# EAGLE design LDR ACC (EAGLE 9.0.0)
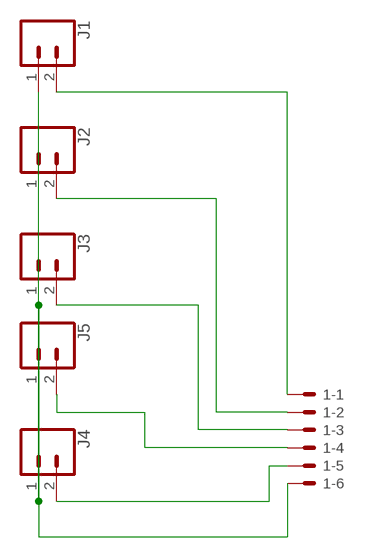
[diagram p0: schematic, sheet 1]

## Parts
1  5566-6  [5566-6]
J1  CONN_02PTH3  [1X02_LONGPADS]
J2  CONN_02PTH3  [1X02_LONGPADS]
J3  CONN_02PTH3  [1X02_LONGPADS]
J4  CONN_02PTH3  [1X02_LONGPADS]
J5  CONN_02PTH3  [1X02_LONGPADS]

## Nets
N$1: 1.6 J1.1 J2.1 J3.1 J4.1 J5.1
N$2: 1.5 J4.2
N$3: 1.4 J5.2
N$5: 1.3 J3.2
N$6: 1.2 J2.2
N$7: 1.1 J1.2

## Library data of the parts
1 = con-molex:5566-6: Mini FIT connector 6 pol Source: http://www.molex.com; MF: MOLEX; MPN: 95566-61002; OC_FARNELL: unknown; OC_NEWARK: 22K8620
J1-J5 = SparkFun-Connectors:CONN_02: Multi connection point. Often used as Generic Header-pin footprint for 0.1 inch spaced/style header connections On any of the 0.1 inch spaced packages, you can populate with these: Break Away Headers - Straight <https://www.sparkfun.com/products/116> (PRT-00116) Break Away Male Headers - Right Angle <https://www.sparkfun.com/products/553> (PRT-00553) Female Headers <https://www.sparkfun.com/products/115> (PRT-00115) Break Away Headers - Machine Pin <https://www.sparkfun.com/products/117> (PRT-00117) Break Away Female Headers - Swiss Machine Pin <https://www.sparkfun.com/products/743> (PRT-00743) For SCREWTERMINALS and SPRING TERMINALS visit here: Screw Terimnals on SparkFun.com <https://www.sparkfun.com/search/results?term=Screw+Terminals> (5mm/3.5mm/2.54mm spacing) This device is also useful as a general connection point to wire up your design to another part of your project. Our various solder wires solder well into these plated through hole pads. Hook-Up Wire - Assortment (Stranded, 22 AWG) <https://www.sparkfun.com/products/11375> (PRT-11375) Hook-Up Wire - Assortment (Solid Core, 22 AWG) <https://www.sparkfun.com/products/11367> (PRT-11367) View the entire wire category on our website here <https://www.sparkfun.com/categories/141> Special notes: Molex polarized connector foot print use with: PRT-08233 with associated crimp pins and housings. 2.54_SCREWTERM for use with PRT-10571. 3.5mm Screw Terminal footprints for PRT-08084 5mm Screw Terminal footprints for use with PRT-08432

## Board
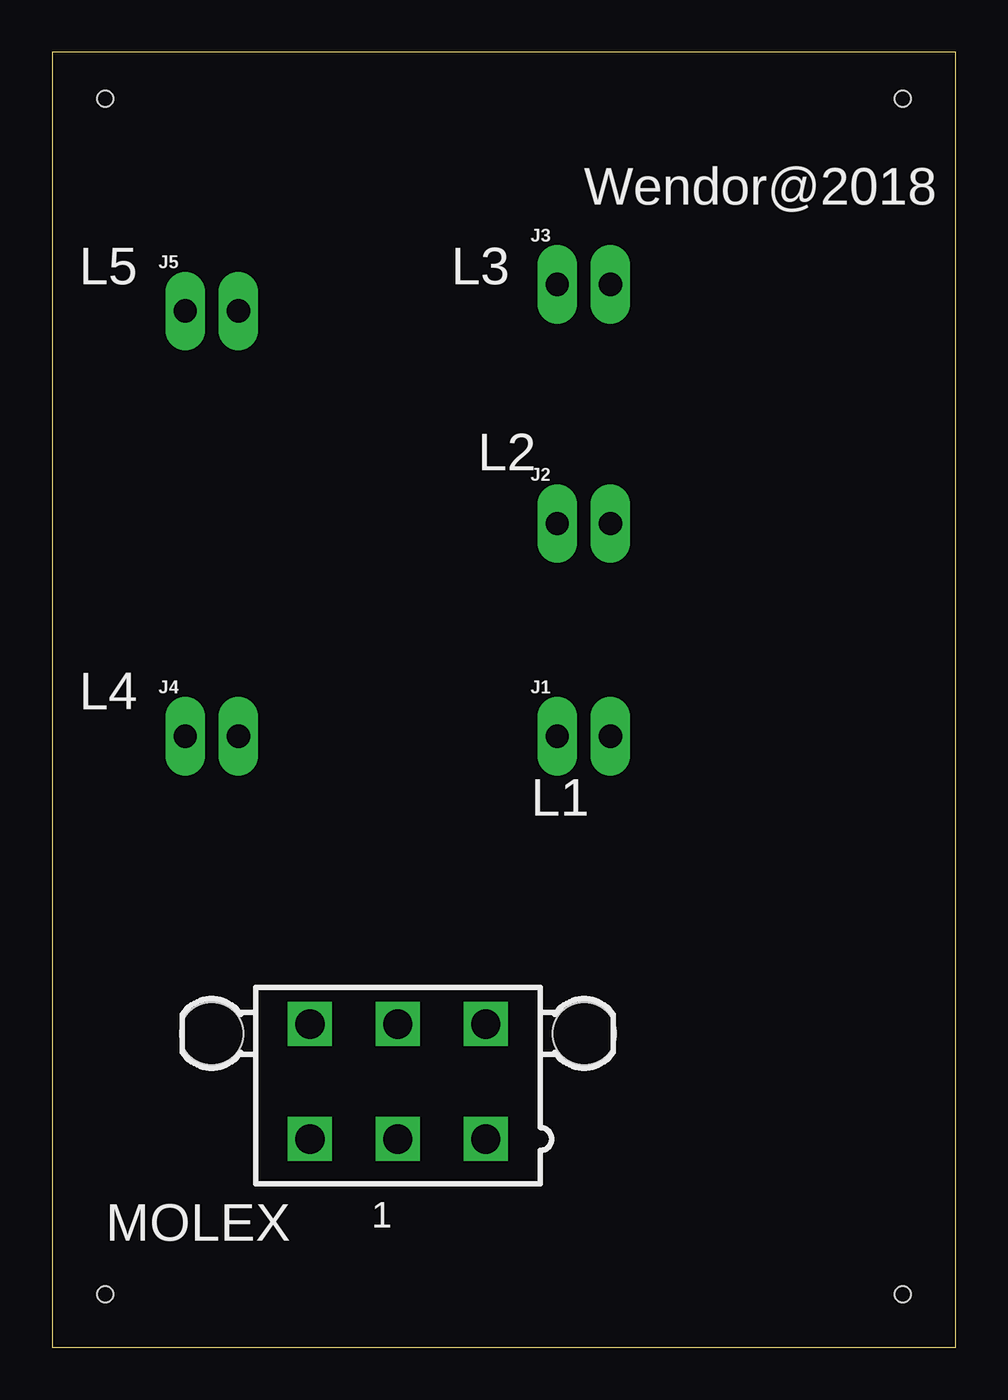
[diagram p1: board, top side]
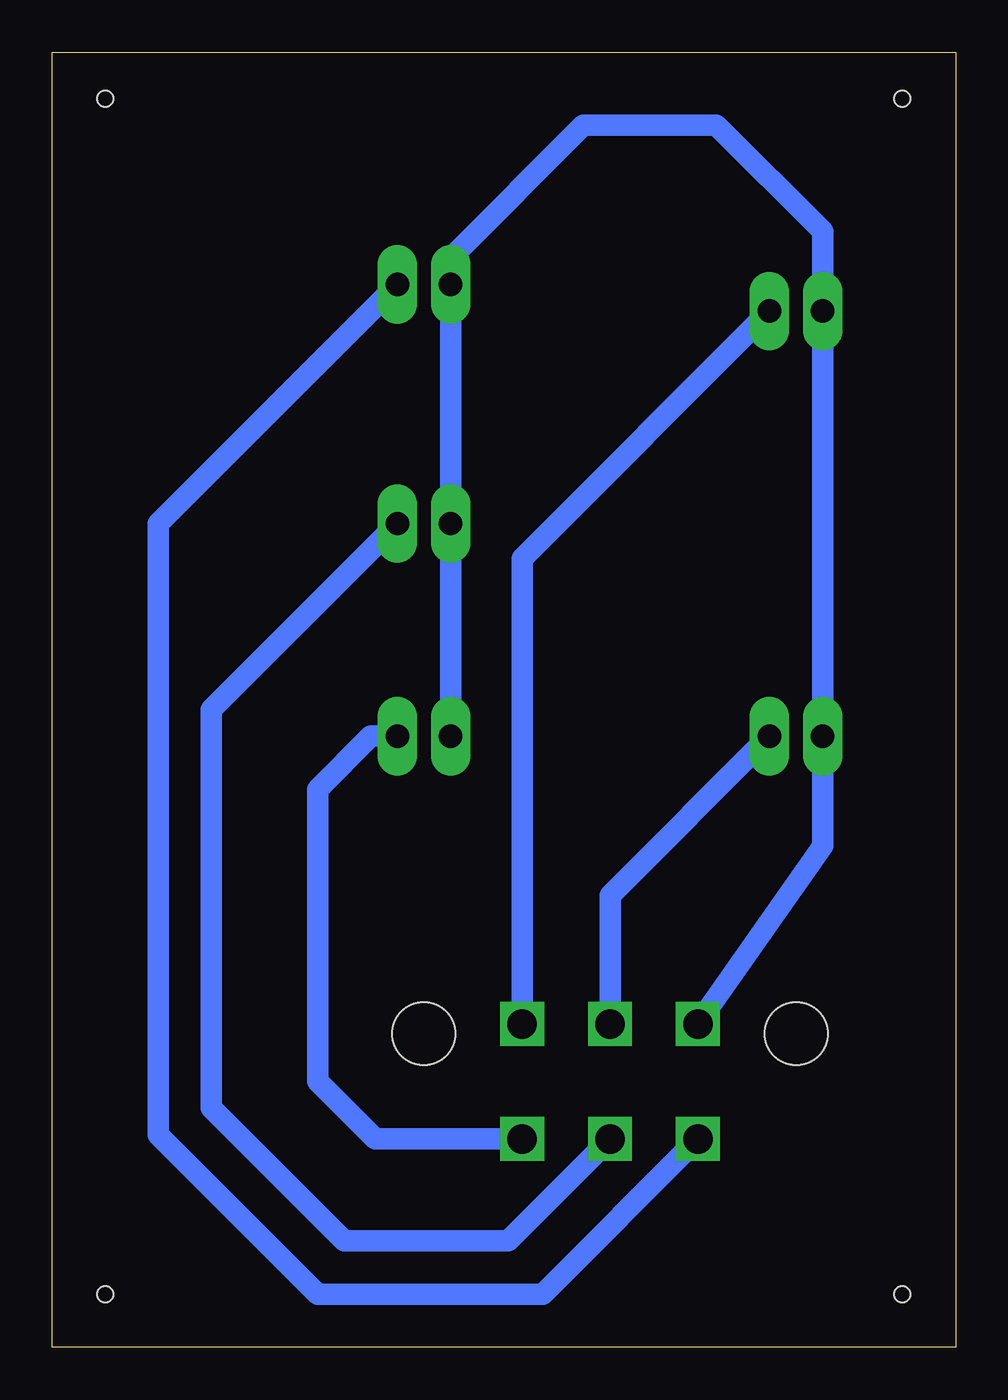
[diagram p2: board, bottom side, seen from below]

Size 43.16 x 61.9 mm. Coordinates in mm from the lower left corner, seen from the top.
Outline: 0,0 43.16,0 43.16,61.9 0,61.9 0,0
Copper layers (1*16): Top 0.035mm / dielectric 1.5mm / Bottom 0.035mm
Design rules "default *": minimum track width 40mil, minimum drill 0.35mm, track to track 20mil, track to pad 6mil, pad to pad 6mil, via to via 6mil, smd to smd 6mil, copper to edge 40mil, drill to drill 6mil, minimum pad ring 10mil, minimum via ring 8mil, stop-mask expansion 4mil, vias tented up to drill 0mil, thermal gap 10mil
Holes 0.76 mm at 40.64,59.69 40.64,2.54 2.54,2.54 2.54,59.69

### Footprints (pad centres in the part's own frame; a part is rotated, then mirrored left to right if it is on the bottom)
5566-6 = drill 1.4 square: 1 4.2,-2.75; 2 0,-2.75; 3 -4.2,-2.75; 4 4.2,2.75; 5 0,2.75; 6 -4.2,2.75 | hole 3: 8.9,2.29; -8.9,2.29
1X02_LONGPADS = drill 1.118 pad 1.88 long: 1 0,0; 2 2.54,0

### Placement (x,y rotation side)
1  16.51,12.7 0 top
J1  24.13,29.21 0 top
J2  24.13,39.37 0 top
J3  24.13,50.8 0 top
J4  6.35,29.21 0 top
J5  6.35,49.53 0 top

### Tracks (layer width: path | path; a pad name or v marks a point on that pad's centre or on a via)
N$1
  Bottom 1.016: 1.6 6.35,23.95 J4.1 J5.1 6.35,53.34 11.43,58.42 17.78,58.42 24.13,52.07 J3.1 J2.1 J1.1
N$2
  Bottom 1.016: J4.2 16.51,21.59 1.5
N$3
  Bottom 1.016: J5.2 20.71,37.71 1.4
N$5
  Bottom 1.016: J3.2 38.1,39.37 38.1,10.16 30.48,2.54 19.72,2.54 1.3
N$6
  Bottom 1.016: J2.2 35.56,30.48 35.56,11.43 29.21,5.08 21.38,5.08 1.2
N$7
  Bottom 1.016: 1.1 27.73,9.95 30.48,12.7 30.48,26.67 27.94,29.21 J1.2

### Text on the board
tNames: Wendor@2018 | L5 | L3 | L2 | L4 | L1 | MOLEX